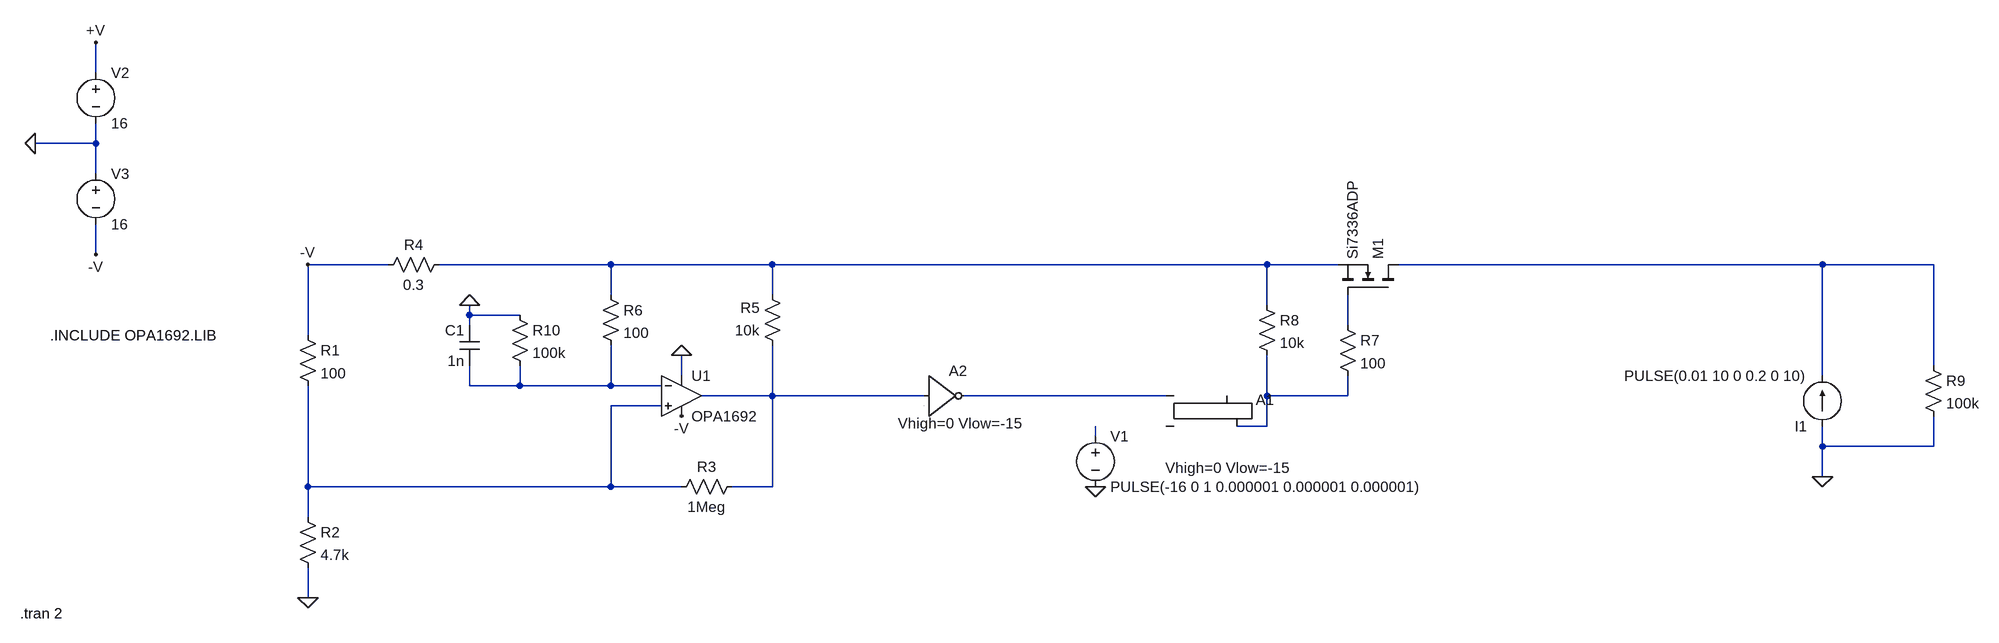
[diagram p0: schematic Current limit - negative.asc]
Current limit - negative.asc, the LTspice schematic file:
Version 4
SHEET 1 1844 680
WIRE -1216 -384 -1216 -432
WIRE -1216 -272 -1216 -304
WIRE -1216 -272 -1312 -272
WIRE -1216 -224 -1216 -272
WIRE -1216 -96 -1216 -144
WIRE -752 -80 -880 -80
WIRE -400 -80 -672 -80
WIRE -144 -80 -400 -80
WIRE 640 -80 -144 -80
WIRE 752 -80 640 -80
WIRE 1520 -80 848 -80
WIRE 1696 -80 1520 -80
WIRE -400 -32 -400 -80
WIRE -144 -32 -144 -80
WIRE 640 -16 640 -80
WIRE -624 0 -624 -16
WIRE -544 0 -624 0
WIRE -624 16 -624 0
WIRE 768 16 768 -32
WIRE -880 32 -880 -80
WIRE 1696 80 1696 -80
WIRE -288 96 -288 64
WIRE 1520 96 1520 -80
WIRE -624 112 -624 80
WIRE -544 112 -544 80
WIRE -544 112 -624 112
WIRE -400 112 -400 48
WIRE -400 112 -544 112
WIRE -320 112 -400 112
WIRE -144 128 -144 48
WIRE -144 128 -256 128
WIRE 96 128 -144 128
WIRE 480 128 160 128
WIRE 640 128 640 64
WIRE 768 128 768 96
WIRE 768 128 640 128
WIRE -320 144 -400 144
WIRE 640 176 640 128
WIRE 640 176 592 176
WIRE 368 192 368 176
WIRE 1520 208 1520 176
WIRE 1696 208 1696 160
WIRE 1696 208 1520 208
WIRE 1520 256 1520 208
WIRE -880 272 -880 112
WIRE -400 272 -400 144
WIRE -400 272 -880 272
WIRE -288 272 -400 272
WIRE -144 272 -144 128
WIRE -144 272 -208 272
WIRE -880 320 -880 272
WIRE -880 448 -880 400
FLAG -880 -80 -V
FLAG -880 448 0
FLAG 368 272 0
FLAG -624 -16 0
FLAG -1312 -272 0
FLAG -1216 -432 +V
FLAG -1216 -96 -V
FLAG -288 160 -V
FLAG 1520 256 0
FLAG -288 64 0
SYMBOL res -896 16 R0
SYMATTR InstName R1
SYMATTR Value 100
SYMBOL res -896 304 R0
SYMATTR InstName R2
SYMATTR Value 4.7k
SYMBOL res -192 256 R90
WINDOW 0 0 56 VBottom 2
WINDOW 3 32 56 VTop 2
SYMATTR InstName R3
SYMATTR Value 1Meg
SYMBOL res -656 -96 R90
WINDOW 0 0 56 VBottom 2
WINDOW 3 32 56 VTop 2
SYMATTR InstName R4
SYMATTR Value 0.3
SYMBOL res -128 64 R180
WINDOW 0 36 76 Left 2
WINDOW 3 36 40 Left 2
SYMATTR InstName R5
SYMATTR Value 10k
SYMBOL Digital\\srflop 528 80 R0
WINDOW 39 -49 162 Left 2
SYMATTR SpiceLine Vhigh=0 Vlow=-15
SYMATTR InstName A1
SYMBOL voltage 368 176 R0
WINDOW 123 0 0 Left 0
WINDOW 39 0 0 Left 0
SYMATTR InstName V1
SYMATTR Value PULSE(-16 0 1 0.000001 0.000001 0.000001)
SYMBOL OpAmps\\opamp2 -288 64 R0
SYMATTR InstName U1
SYMATTR Value OPA1692
SYMBOL res -416 -48 R0
SYMATTR InstName R6
SYMATTR Value 100
SYMBOL cap -608 80 R180
WINDOW 0 24 56 Left 2
WINDOW 3 24 8 Left 2
SYMATTR InstName C1
SYMATTR Value 1n
SYMBOL voltage -1216 -400 R0
WINDOW 123 0 0 Left 0
WINDOW 39 0 0 Left 0
SYMATTR InstName V2
SYMATTR Value 16
SYMBOL voltage -1216 -240 R0
WINDOW 123 0 0 Left 0
WINDOW 39 0 0 Left 0
SYMATTR InstName V3
SYMATTR Value 16
SYMBOL res 752 0 R0
SYMATTR InstName R7
SYMATTR Value 100
SYMBOL current 1520 176 R180
WINDOW 123 0 0 Left 0
WINDOW 39 0 0 Left 0
SYMATTR InstName I1
SYMATTR Value PULSE(0.01 10 0 0.2 0 10)
SYMBOL res 624 -32 R0
SYMATTR InstName R8
SYMATTR Value 10k
SYMBOL nmos 848 -32 M270
SYMATTR InstName M1
SYMATTR Value Si7336ADP
SYMBOL res 1680 64 R0
SYMATTR InstName R9
SYMATTR Value 100k
SYMBOL res -560 -16 R0
SYMATTR InstName R10
SYMATTR Value 100k
SYMBOL Digital\\inv 96 64 R0
WINDOW 39 -41 107 Left 2
SYMATTR SpiceLine Vhigh=0 Vlow=-15
SYMATTR InstName A2
TEXT -1288 32 Left 2 !.INCLUDE OPA1692.LIB
TEXT -1336 472 Left 2 !.tran 2

The netlist it stands for:
* Current limit - negative.asc
R1 -V N008 100
R2 N008 0 4.7k
R3 N005 N008 1Meg
R4 N001 -V 0.3
R5 N005 N001 10k
A1 N006 0 0 0 0 N007 0 0 SRFLOP Vhigh=0 Vlow=-15
V1 N009 0 PULSE(-16 0 1 0.000001 0.000001 0.000001)
XU1 N008 N004 0 -V N005 OPA1692  ; pins In+ In- V+ V- OUT
R6 N001 N004 100
C1 N004 0 1n
V2 +V 0 16
V3 0 -V 16
R7 N003 N007 100
I1 0 N002 PULSE(0.01 10 0 0.2 0 10)
R8 N001 N007 10k
M1 N002 N003 N001 N001 Si7336ADP
R9 N002 0 100k
R10 0 N004 100k
A2 N005 0 0 0 0 N006 0 0 BUF Vhigh=0 Vlow=-15
.model NMOS NMOS
.model PMOS PMOS
.lib standard.mos
.INCLUDE OPA1692.LIB
.tran 2
.backanno
.end